# Altium schematic sheet Core Analogue Inputs.SchDoc: Ravage - Core Analogue Inputs
size A4; Address1: Drawn By:; Address2: Dan Visser; DocumentNumber: A; Revision: 0.1-alpha; SheetNumber: 6; SheetTotal: 16
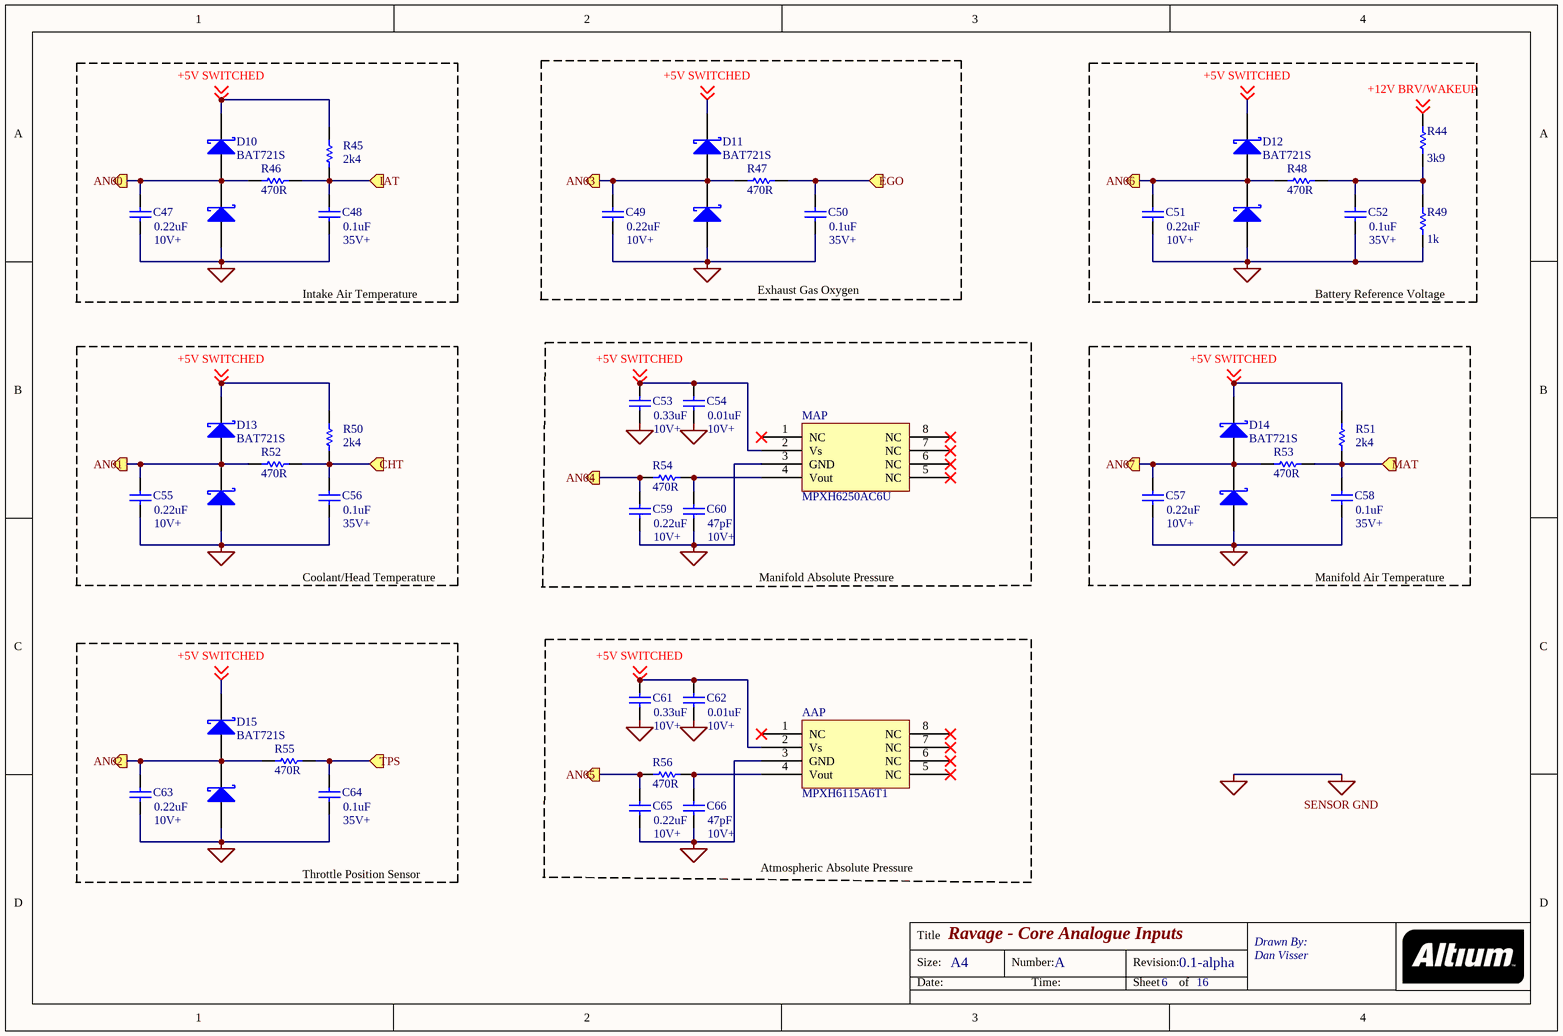
[diagram p0: Core Analogue Inputs.SchDoc]

## Parts
AAP  MPXH6115A6T1
C47  value 0.22uF  [RAD-0.3]
C48  value 0.1uF  [RAD-0.3]
C49  value 0.22uF  [RAD-0.3]
C50  value 0.1uF  [RAD-0.3]
C51  value 0.22uF  [RAD-0.3]
C52  value 0.1uF  [RAD-0.3]
C53  value 0.33uF  [RAD-0.3]
C54  value 0.01uF  [RAD-0.3]
C55  value 0.22uF  [RAD-0.3]
C56  value 0.1uF  [RAD-0.3]
C57  value 0.22uF  [RAD-0.3]
C58  value 0.1uF  [RAD-0.3]
C59  value 0.22uF  [RAD-0.3]
C60  value 47pF  [RAD-0.3]
C61  value 0.33uF  [RAD-0.3]
C62  value 0.01uF  [RAD-0.3]
C63  value 0.22uF  [RAD-0.3]
C64  value 0.1uF  [RAD-0.3]
C65  value 0.22uF  [RAD-0.3]
C66  value 47pF  [RAD-0.3]
D10  BAT721S
D11  BAT721S
D12  BAT721S
D13  BAT721S
D14  BAT721S
D15  BAT721S
MAP  MPXH6250AC6U
R44  value 3k9  [AXIAL-0.3]
R45  value 2k4  [AXIAL-0.3]
R46  value 470R  [AXIAL-0.3]
R47  value 470R  [AXIAL-0.3]
R48  value 470R  [AXIAL-0.3]
R49  value 1k  [AXIAL-0.3]
R50  value 2k4  [AXIAL-0.3]
R51  value 2k4  [AXIAL-0.3]
R52  value 470R  [AXIAL-0.3]
R53  value 470R  [AXIAL-0.3]
R54  value 470R  [AXIAL-0.3]
R55  value 470R  [AXIAL-0.3]
R56  value 470R  [AXIAL-0.3]

## Ports
AN00 (out), AN01 (out), AN02 (out), AN03 (out), AN04 (out), AN05 (out), AN06 (out), AN07 (out), CHT (in), EGO (in), IAT (in), MAT (in), TPS (in)

## Nets
SENSOR GND: AAP.3(GND) C47.1 C48.1 C49.1 C50.1 C51.1 C52.1 C53.1 C54.1 C55.1 C56.1 C57.1 C58.1 C59.1 C60.1 C61.1 C62.1 C63.1 C64.1 C65.1 C66.1 D10.1(A) D11.1(A) D12.1(A) D13.1(A) D14.1(A) D15.1(A) MAP.3(GND) R49.1
+5V SWITCHED: AAP.2(Vs) C53.2 C54.2 C61.2 C62.2 D10.2(K) D11.2(K) D12.2(K) D13.2(K) D14.2(K) D15.2(K) MAP.2(Vs) R45.1 R50.1 R51.1 ; off-sheet +5V SWITCHED
+12V BRV/WAKEUP: R44.2 ; off-sheet +12V BRV/WAKEUP
AN00: C47.2 D10.3(A2) R46.1 ; port AN00
AN01: C55.2 D13.3(A2) R52.1 ; port AN01
AN02: C63.2 D15.3(A2) R55.1 ; port AN02
AN03: C49.2 D11.3(A2) R47.1 ; port AN03
AN04: C59.2 R54.1 ; port AN04
AN05: C65.2 R56.1 ; port AN05
AN06: C51.2 D12.3(A2) R48.1 ; port AN06
AN07: C57.2 D14.3(A2) R53.1 ; port AN07
CHT: C56.2 R50.2 R52.2 ; port CHT
EGO: C50.2 R47.2 ; port EGO
IAT: C48.2 R45.2 R46.2 ; port IAT
MAT: C58.2 R51.2 R53.2 ; port MAT
TPS: C64.2 R55.2 ; port TPS
NetAAP_4: AAP.4(Vout) C66.2 R56.2
NetC52_2: C52.2 R44.1 R48.2 R49.2
NetC60_2: C60.2 MAP.4(Vout) R54.2

Not connected (* = marked no-connect by the designer): AAP 1(NC)* 5(NC)* 6(NC)* 7(NC)* 8(NC)*; MAP 1(NC)* 5(NC)* 6(NC)* 7(NC)* 8(NC)*

## Notes on the sheet
- (near C47) 10V+
- (near C48) 35V+
- (near C49) 10V+
- (near C50) 35V+
- (near C51) 10V+
- 35V+
- Intake Air Temperature
- Exhaust Gas Oxygen
- Battery Reference Voltage
- 10V+
- (near C54) 10V+
- (near C55) 10V+
- Coolant/Head Temperature
- (near C56) 35V+
- (near C60) 10V+
- Manifold Absolute Pressure
- (near C57) 10V+
- Manifold Air Temperature
- (near C58) 35V+
- (near C62) 10V+
- (near C63) 10V+
- (near C64) 35V+
- (near C66) 10V+
- Throttle Position Sensor
- Atmospheric Absolute Pressure
- Title
- Size:
- Date:
- A4
- Number:
- Time:
- Revision:
- Sheet
- of

## Library data of the parts
C47-C66 = Cap: Capacitor; Published: 8-Jun-2000; LatestRevisionDate: 17-Jul-2002; LatestRevisionNote: Re-released for DXP Platform.; PackageReference: RAD-0.3; Publisher: Altium Limited; PackageDescription: Radial Cap, Thru-Hole; 2 Leads; 0.3 in Pin Spacing
D10-D15 = BAT721S: DUAL SCHOTTKY DIODE
R44-R56 = Res1: Resistor; Published: 8-Jun-2000; LatestRevisionDate: 17-Jul-2002; LatestRevisionNote: Re-released for DXP Platform.; PackageReference: AXIAL-0.3; Publisher: Altium Limited; PackageDescription: Axial Device, Thru-Hole; 2 Leads; 0.3 in Pin Spacing